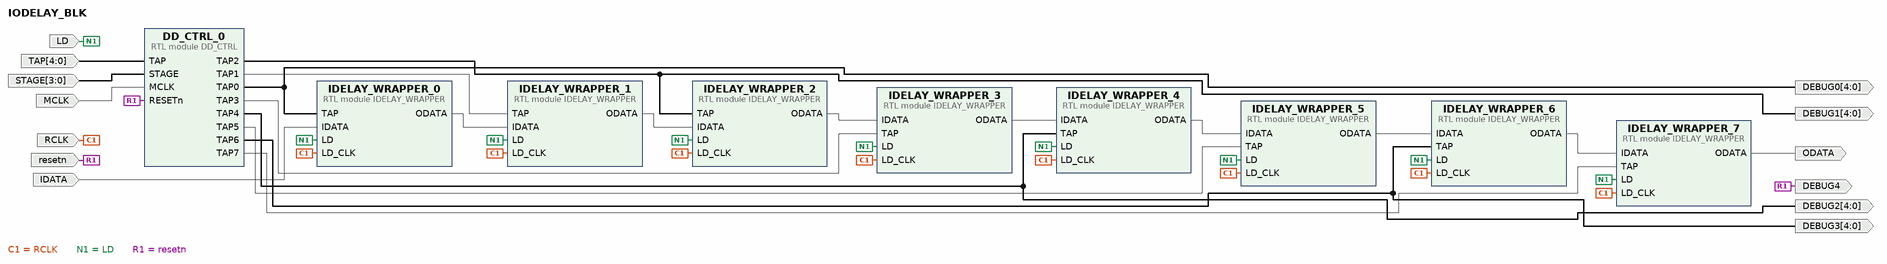
[diagram p0: block diagram of the top level]
# Vivado block design IODELAY_BLK, xc7z020clg400-1, Vivado 2019.1
create_bd_design IODELAY_BLK

create_bd_port -dir I IDATA
create_bd_port -dir I -from 4 -to 0 TAP
create_bd_port -dir I -from 3 -to 0 STAGE
create_bd_port -dir I -type clk RCLK
set_property -dict {CONFIG.FREQ_HZ 310000000} [get_bd_ports RCLK]
create_bd_port -dir I -type rst resetn
create_bd_port -dir I -type clk MCLK
set_property -dict {CONFIG.FREQ_HZ 460000000} [get_bd_ports MCLK]
create_bd_port -dir I LD
create_bd_port -dir O ODATA
create_bd_port -dir O -from 4 -to 0 DEBUG0
create_bd_port -dir O -from 4 -to 0 DEBUG1
create_bd_port -dir O -from 4 -to 0 DEBUG2
create_bd_port -dir O -from 4 -to 0 DEBUG3
create_bd_port -dir O DEBUG4

create_bd_cell -type module -reference IDELAY_WRAPPER IDELAY_WRAPPER_0
create_bd_cell -type module -reference IDELAY_WRAPPER IDELAY_WRAPPER_1
create_bd_cell -type module -reference IDELAY_WRAPPER IDELAY_WRAPPER_2
create_bd_cell -type module -reference IDELAY_WRAPPER IDELAY_WRAPPER_3
create_bd_cell -type module -reference IDELAY_WRAPPER IDELAY_WRAPPER_4
create_bd_cell -type module -reference IDELAY_WRAPPER IDELAY_WRAPPER_5
create_bd_cell -type module -reference IDELAY_WRAPPER IDELAY_WRAPPER_6
create_bd_cell -type module -reference IDELAY_WRAPPER IDELAY_WRAPPER_7
create_bd_cell -type module -reference DD_CTRL DD_CTRL_0

# ---- connections ----

connect_bd_net [get_bd_pins IDELAY_WRAPPER_0/ODATA] [get_bd_pins IDELAY_WRAPPER_1/IDATA]
connect_bd_net [get_bd_pins IDELAY_WRAPPER_1/ODATA] [get_bd_pins IDELAY_WRAPPER_2/IDATA]
connect_bd_net [get_bd_pins IDELAY_WRAPPER_2/ODATA] [get_bd_pins IDELAY_WRAPPER_3/IDATA]
connect_bd_net [get_bd_pins IDELAY_WRAPPER_3/ODATA] [get_bd_pins IDELAY_WRAPPER_4/IDATA]
connect_bd_net [get_bd_pins IDELAY_WRAPPER_4/ODATA] [get_bd_pins IDELAY_WRAPPER_5/IDATA]
connect_bd_net [get_bd_pins IDELAY_WRAPPER_5/ODATA] [get_bd_pins IDELAY_WRAPPER_6/IDATA]
connect_bd_net [get_bd_pins IDELAY_WRAPPER_6/ODATA] [get_bd_pins IDELAY_WRAPPER_7/IDATA]
connect_bd_net [get_bd_ports RCLK] \
  [get_bd_pins IDELAY_WRAPPER_6/LD_CLK] [get_bd_pins IDELAY_WRAPPER_7/LD_CLK] [get_bd_pins IDELAY_WRAPPER_3/LD_CLK] \
  [get_bd_pins IDELAY_WRAPPER_2/LD_CLK] [get_bd_pins IDELAY_WRAPPER_1/LD_CLK] [get_bd_pins IDELAY_WRAPPER_5/LD_CLK] \
  [get_bd_pins IDELAY_WRAPPER_0/LD_CLK] [get_bd_pins IDELAY_WRAPPER_4/LD_CLK]
connect_bd_net [get_bd_ports LD] \
  [get_bd_pins IDELAY_WRAPPER_4/LD] [get_bd_pins IDELAY_WRAPPER_0/LD] [get_bd_pins IDELAY_WRAPPER_1/LD] \
  [get_bd_pins IDELAY_WRAPPER_5/LD] [get_bd_pins IDELAY_WRAPPER_2/LD] [get_bd_pins IDELAY_WRAPPER_6/LD] \
  [get_bd_pins IDELAY_WRAPPER_3/LD] [get_bd_pins IDELAY_WRAPPER_7/LD]
connect_bd_net [get_bd_pins DD_CTRL_0/TAP0] [get_bd_pins IDELAY_WRAPPER_0/TAP] [get_bd_ports DEBUG0]
connect_bd_net [get_bd_pins DD_CTRL_0/TAP1] [get_bd_pins IDELAY_WRAPPER_1/TAP]
connect_bd_net [get_bd_pins DD_CTRL_0/TAP2] [get_bd_pins IDELAY_WRAPPER_2/TAP] [get_bd_ports DEBUG1]
connect_bd_net [get_bd_pins DD_CTRL_0/TAP3] [get_bd_pins IDELAY_WRAPPER_3/TAP]
connect_bd_net [get_bd_pins DD_CTRL_0/TAP4] [get_bd_pins IDELAY_WRAPPER_4/TAP] [get_bd_ports DEBUG2]
connect_bd_net [get_bd_pins DD_CTRL_0/TAP5] [get_bd_pins IDELAY_WRAPPER_5/TAP]
connect_bd_net [get_bd_pins DD_CTRL_0/TAP6] [get_bd_pins IDELAY_WRAPPER_6/TAP] [get_bd_ports DEBUG3]
connect_bd_net [get_bd_pins DD_CTRL_0/TAP7] [get_bd_pins IDELAY_WRAPPER_7/TAP]
connect_bd_net [get_bd_ports IDATA] [get_bd_pins IDELAY_WRAPPER_0/IDATA]
connect_bd_net [get_bd_ports TAP] [get_bd_pins DD_CTRL_0/TAP]
connect_bd_net [get_bd_ports STAGE] [get_bd_pins DD_CTRL_0/STAGE]
connect_bd_net [get_bd_ports resetn] [get_bd_pins DD_CTRL_0/RESETn] [get_bd_ports DEBUG4]
connect_bd_net [get_bd_ports MCLK] [get_bd_pins DD_CTRL_0/MCLK]
connect_bd_net [get_bd_pins IDELAY_WRAPPER_7/ODATA] [get_bd_ports ODATA]

validate_bd_design
save_bd_design
